# EAGLE design attinier85-batty-shield-mk-1.0 (EAGLE 6.5.0)
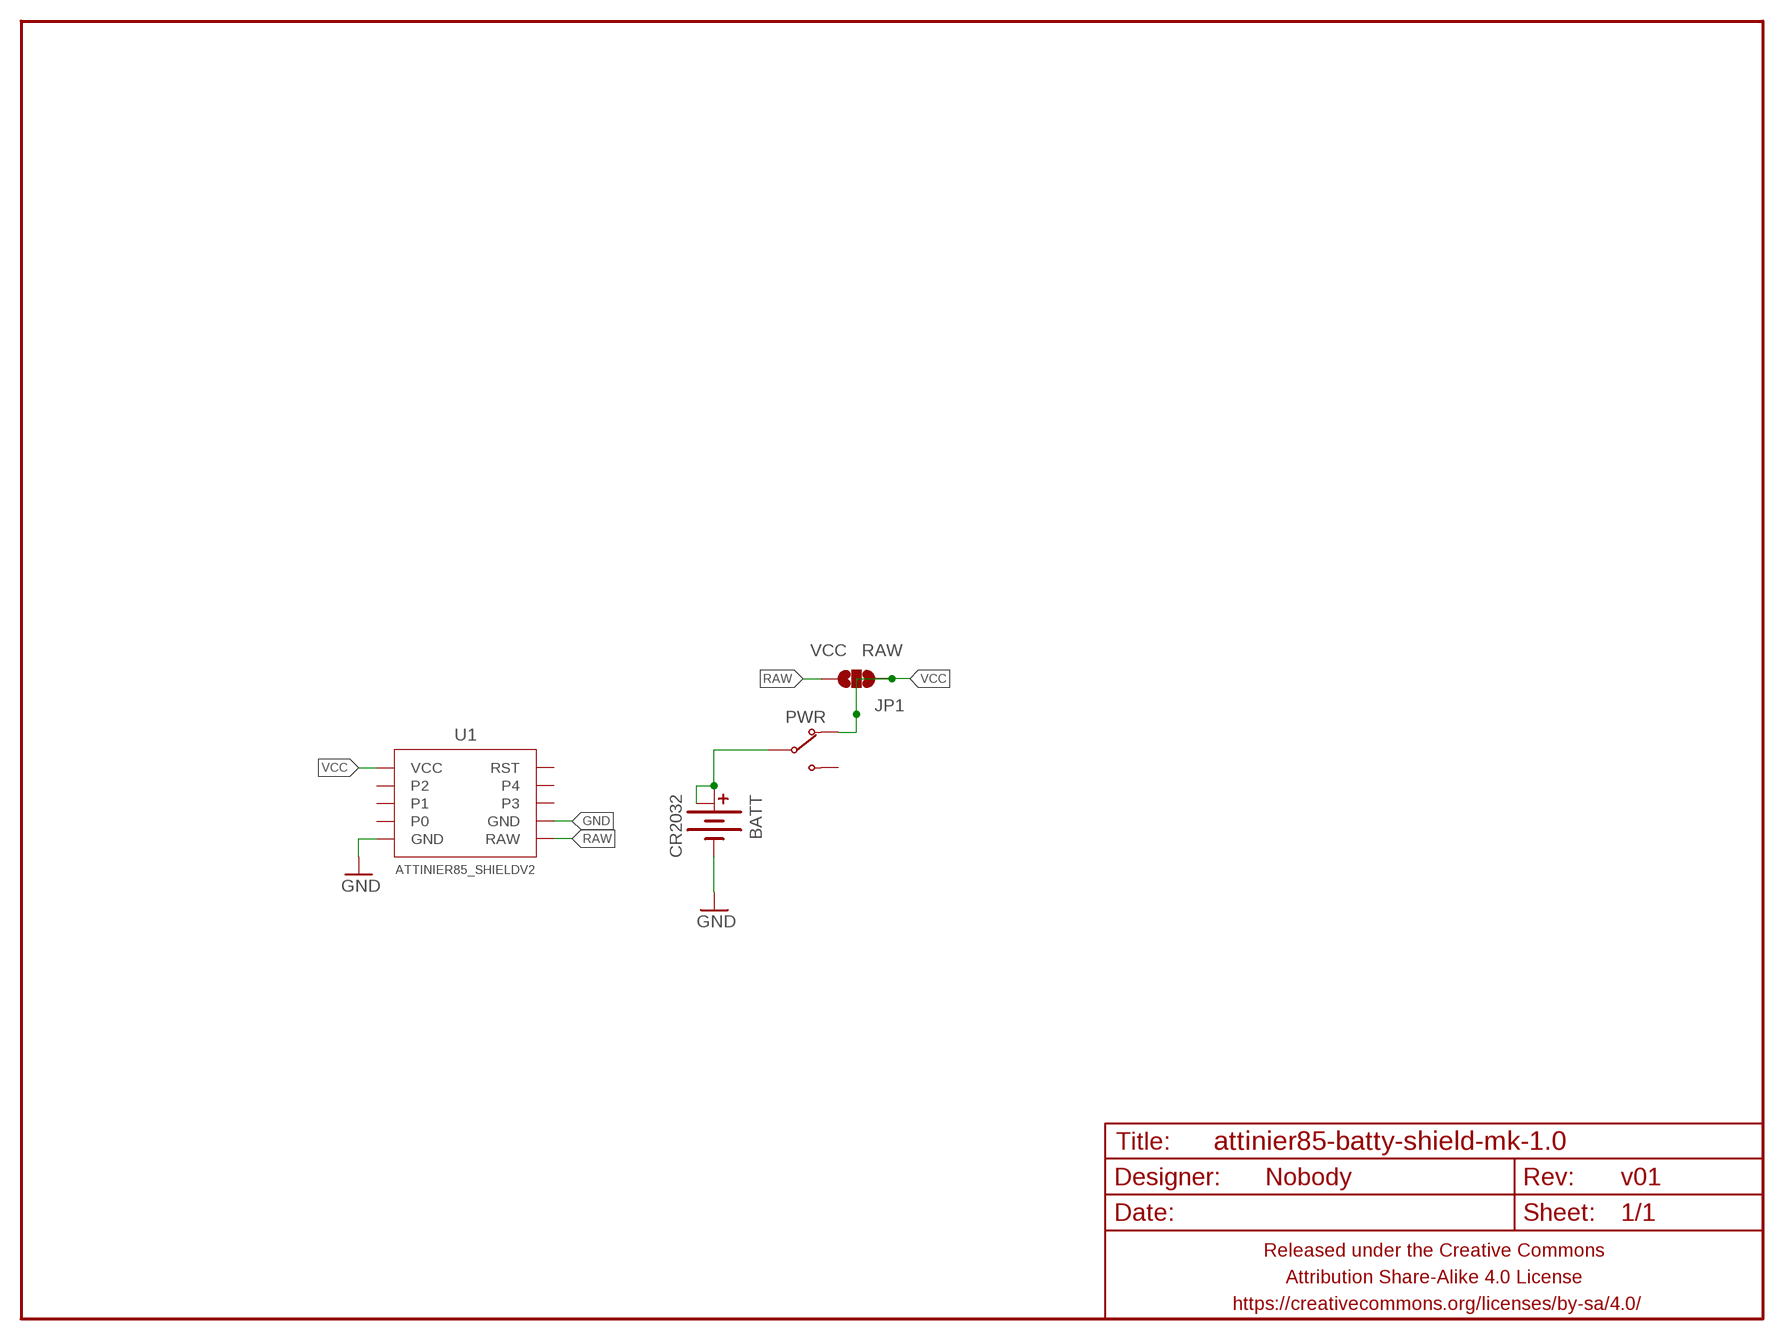
[diagram p0: schematic, sheet 1]

## Parts
BATT  CR2032  BATTERY-COINCR2032_SMD  [BATTCON_20MM_MINE]
FRAME1  FRAME-LETTERNO_PACKAGE  [DUMMY]
JP1  VCC RAW  JUMPER-PAD-3-NOFULL_BOX_SILK  [PAD-JUMPER-3-NO_YES_SILK_FULL_BOX]
PWR  SWITCH-SPDTPTH-RA-2MM  [SPDT-RA-2MM]
U1  ATTINIER85_SHIELDV2  [ATTINIER85_SHIELD_V2]

## Nets
GND: BATT.BOTTOM(-) U1.GND@1(GND) U1.GND@2(GND)
RAW: JP1.1 U1.RAW
VBATT: BATT.TOP@1(+) BATT.TOP@2(+1) PWR.2(COM)
VCC: JP1.2 JP1.3 PWR.1(NC) U1.VCC
Unconnected: PWR.3(NO) U1.0 U1.1 U1.2 U1.3 U1.4 U1.RST

## Library data of the parts
BATT = A_butts:BATTERY-COIN
FRAME1 = A_butts:FRAME-LETTER: Schematic Frame Standard 8.5x11 US Letter frame; DESIGNER: Nobody; VERSION: v01
JP1 = A_butts:JUMPER-PAD-3-NO
PWR = A_butts:SWITCH-SPDT
U1 = A_butts:ATTINIER85_SHIELD

## Board
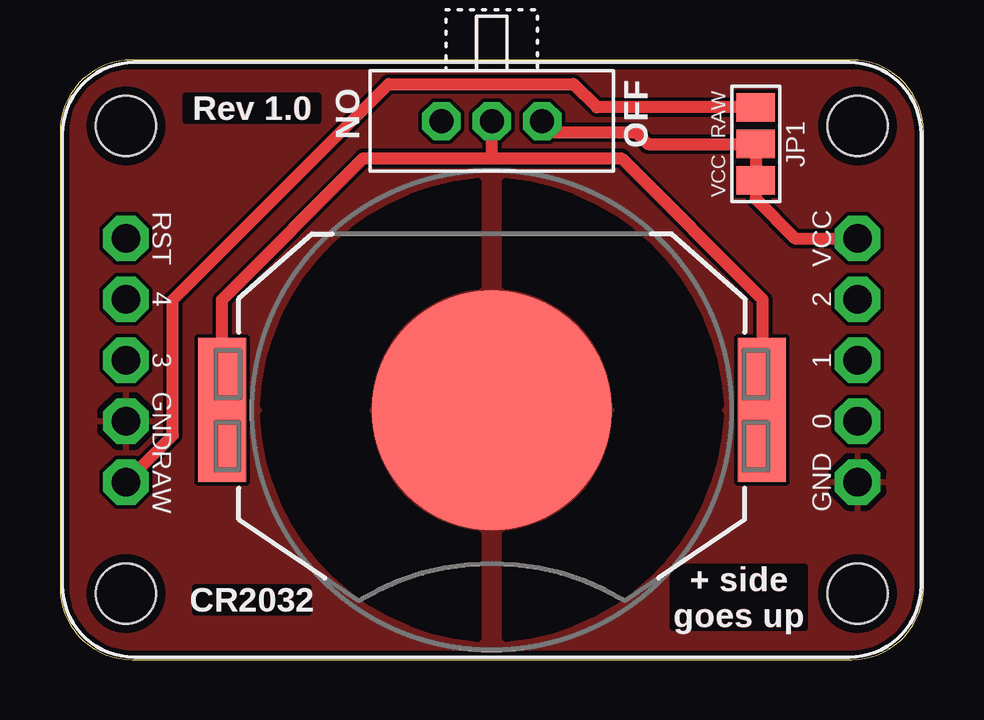
[diagram p1: board, top side]
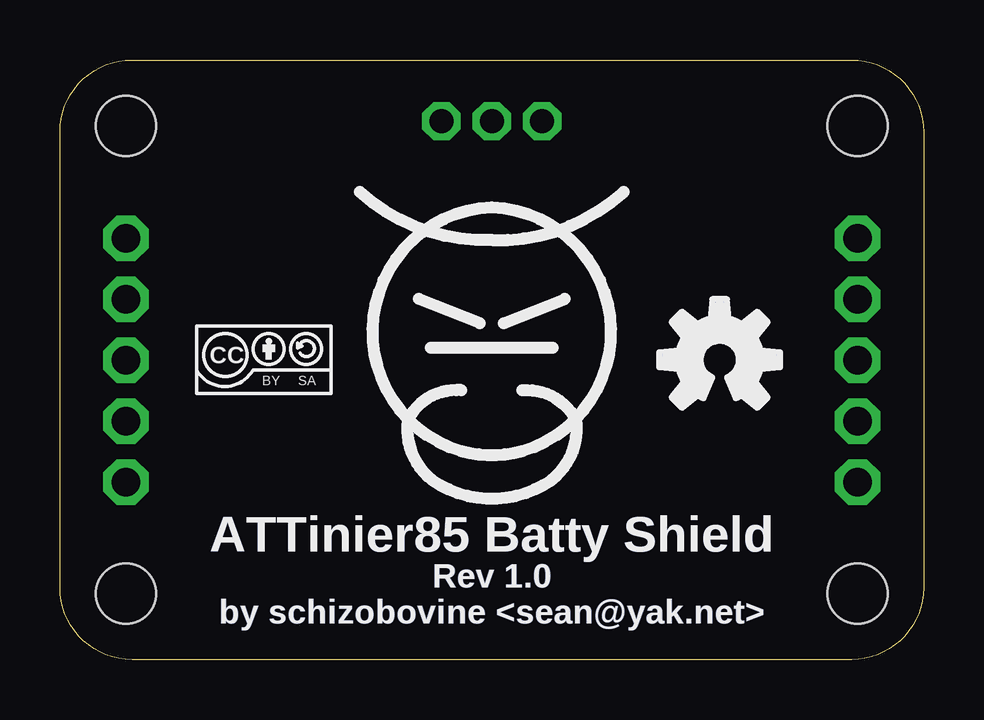
[diagram p2: board, bottom side, seen from below]

Size 36 x 25 mm. Coordinates in mm from the lower left corner, seen from the top.
Outline: 0,22 0,3 arc90 3,0 33,0 arc90 36,3 36,22 arc90 33,25 3,25 arc90 0,22
Copper layers (1*16): Top 0.0356mm / dielectric 1.5011mm / Bottom 0.0356mm
Design rules "LaenPCBOrder_2": minimum track width 6mil, minimum drill 13mil, track to track 6mil, track to pad 6mil, pad to pad 6mil, via to via 6mil, smd to smd 6mil, copper to edge 15mil, drill to drill 6mil, minimum pad ring 7mil, minimum via ring 7mil, stop-mask expansion 3mil, vias tented up to drill 20mil, thermal gap 10mil

### Footprints (pad centres in the part's own frame; a part is rotated, then mirrored left to right if it is on the bottom)
BATTCON_20MM_MINE = smd 10 x 10: BOTTOM 0,0 | smd 6 x 2: TOP@1 0,11.25; TOP@2 0,-11.25
PAD-JUMPER-3-NO_YES_SILK_FULL_BOX = smd 1.2 x 1.6: 1 -1.524,0; 2 0,0; 3 1.524,0
SPDT-RA-2MM = drill 1 pad 1.6 octagon: 1 -2.1,0; 2 0,0; 3 2.1,0
ATTINIER85_SHIELD_V2 = drill 1.2 pad 1.9 octagon: 0 15.25,-2.56; 1 15.25,-0.02; 2 15.25,2.52; 3 -15.25,-0.02; 4 -15.25,2.52; GND@1 -15.25,-2.56; GND@2 15.25,-5.1; RAW -15.25,-5.1; RST -15.25,5.06; VCC 15.25,5.06 | hole 2.5: -15.25,-9.75; -15.25,9.75; 15.25,9.75; 15.25,-9.75

### Placement (x,y rotation side)
BATT  18,10.4 270 top
FRAME1  0,0 0 top
JP1  29,21.5 270 top
PWR  18,22.45 180 top
U1  18,12.5 0 top
U$3  [CC-BY-SA-4.0-NO-URL]  27.5,12.5 0 bottom
U$4  [OSHWLOGO_TOP_0.2]  8.5,12.5 0 bottom
U$6  [COW_METAL]  18,12.5 0 bottom

### Tracks (layer width: path | path; a pad name or v marks a point on that pad's centre or on a via)
GND
  pour Top: -0.1,-0.1 -0.1,25.1 36.1,25.1 36.1,-0.1
RAW
  Top 0.5: JP1.1 22.38,23.02 21.4,24 13.7,24 4.7,15 4.7,9.35 U1.RAW
VBATT
  Top 0.5: BATT.TOP@2 6.75,15 12.65,20.9 18,20.9 | 18,20.9 PWR.2 | BATT.TOP@1 29.3,10.45 29.3,15 23.4,20.9 18,20.9
VCC
  Top 0.5: PWR.1 20.55,22 24,22 24.5,21.5 JP1.2 JP1.3 29,19.2 30.64,17.56 U1.VCC

### Text on the board
Top: + side / goes up | CR2032
Bottom: ATTinier85 Batty Shield
tPlace: ON | OFF | + side / goes up | CR2032
bPlace: ATTinier85 Batty Shield